# EasyEDA Pro project 电路设计.epro

# Schematic Schematic1
Board Name: Board1; Create Date: 2025-09-01; Page Name: P1; Project Name: ROS小车; Schematic Name: Schematic1; Update Date: 2025-09-03; Company: 嘉立创EDA; Page Size: A4; Version: V1.0
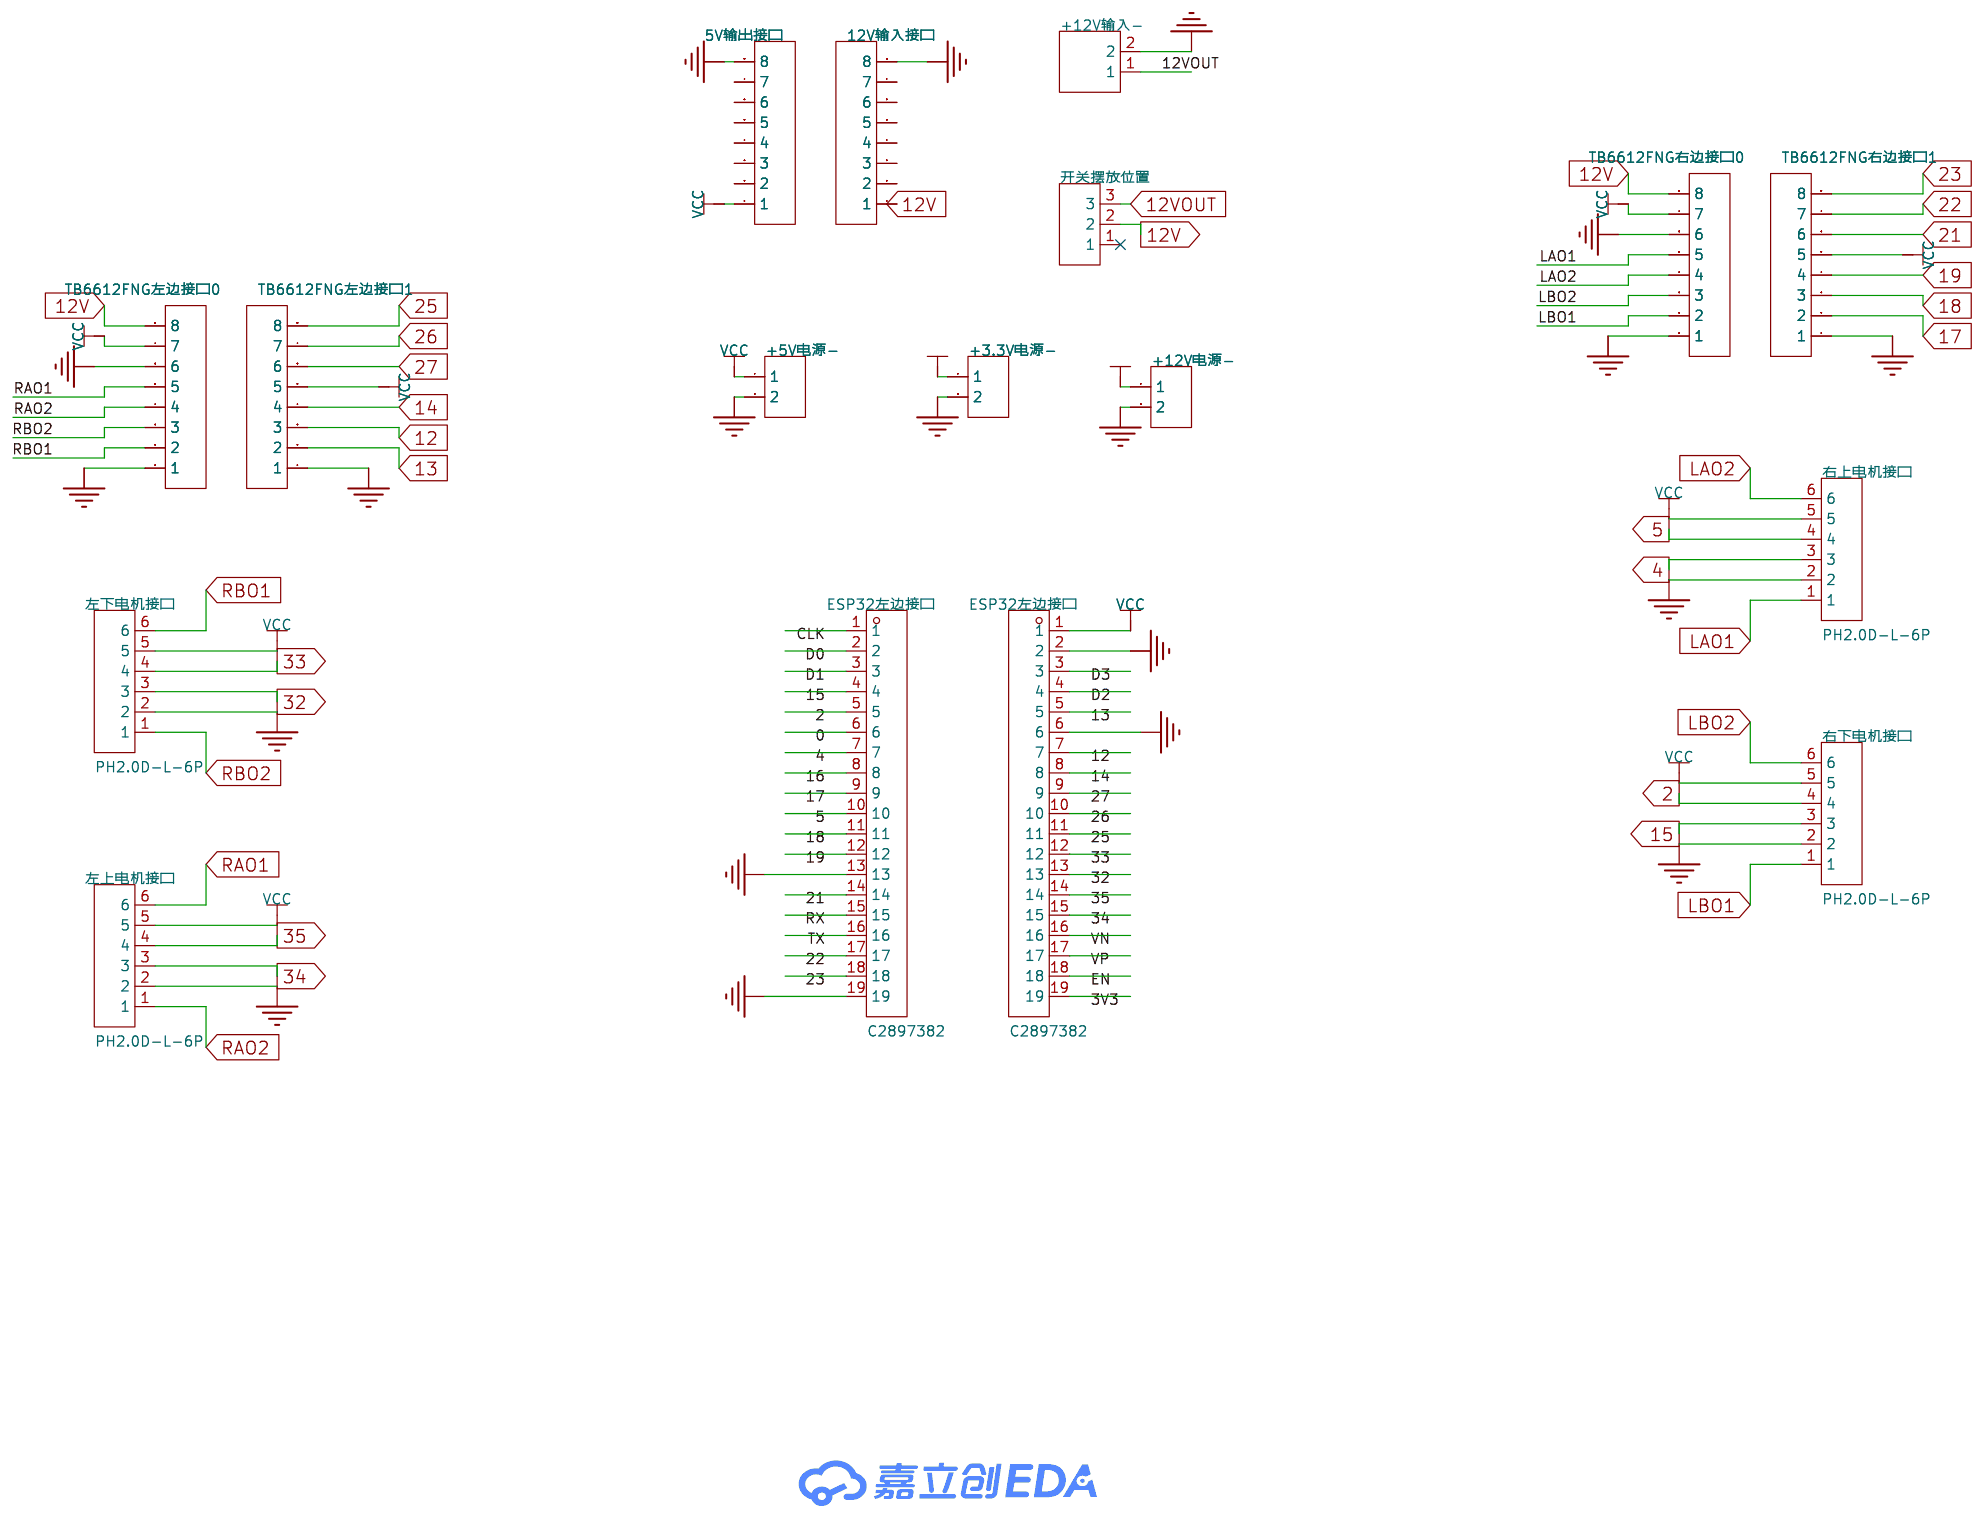
[diagram p0: schematic sheet]

## Parts
5V输出接口  -  [HDR-TH_8P-P2.54-V-F-1]
12V输入接口  -  [HDR-TH_8P-P2.54-V-F-1]
+3.3V电源-  -  [HDR-TH_2P-P2.54-V-F]
+5V电源-  -  [HDR-TH_2P-P2.54-V-F]
+12V电源-  -  [HDR-TH_2P-P2.54-V-F]
+12V输入-  -  [HDR-TH_2P-P2.54-V-M-1]
ESP32左边接口  C2897382  [HDR-TH_19P-P2.54-V-F]
ESP32左边接口#2  C2897382  [HDR-TH_19P-P2.54-V-F]
TB6612FNG右边接口0  -  [HDR-TH_8P-P2.54-V-F-1]
TB6612FNG右边接口1  -  [HDR-TH_8P-P2.54-V-F-1]
TB6612FNG左边接口0  -  [HDR-TH_8P-P2.54-V-F-1]
TB6612FNG左边接口1  -  [HDR-TH_8P-P2.54-V-F-1]
右上电机接口  PH2.0D-L-6P  [CONN-TH_6P_PH2.0D-L-6P]
右下电机接口  PH2.0D-L-6P  [CONN-TH_6P_PH2.0D-L-6P]
左上电机接口  PH2.0D-L-6P  [CONN-TH_6P_PH2.0D-L-6P]
左下电机接口  PH2.0D-L-6P  [CONN-TH_6P_PH2.0D-L-6P]
开关摆放位置  -  [HDR-TH_3P-P2.54-V-F]

## Library data of the parts
5V输出接口 12V输入接口 TB6612FNG右边接口0 TB6612FNG右边接口1 TB6612FNG左边接口0 TB6612FNG左边接口1 = HDR-F_2.54_1x8P: Supplier Part: C27438; Supplier Footprint: 插件
+3.3V电源- +5V电源- +12V电源- = HDR-F_2.54_1x2P: Supplier Part: C49661; Supplier Footprint: 插件
+12V输入- = HDR-M_2.54_1x2P: Supplier Part: C124375; Supplier Footprint: 插件
ESP32左边接口 ESP32左边接口#2 = HDR-F_2.54_1x19P: Supplier Footprint: 插件
右上电机接口 右下电机接口 左上电机接口 左下电机接口 = PH2.0D-L-6P: Supplier Part: C9900007791; Supplier Footprint: PH-6A(RED); JLCPCB Part Class: 扩展库; Supplier: LCSC
开关摆放位置 = HDR-F_2.54_1x3P: Supplier Part: C541850; Supplier Footprint: 插件

## Nets
3V3: +3.3V电源-.1 ESP32左边接口.19
12V: 12V输入接口.1 +12V电源-.1 TB6612FNG右边接口0.8 TB6612FNG左边接口0.8 开关摆放位置.2
12VOUT: +12V输入-.1 开关摆放位置.3
GND: 5V输出接口.8 12V输入接口.8 +3.3V电源-.2 +5V电源-.2 +12V电源-.2 +12V输入-.2 ESP32左边接口.2 ESP32左边接口.6 ESP32左边接口#2.13 ESP32左边接口#2.19 TB6612FNG右边接口0.1 TB6612FNG右边接口0.6 TB6612FNG右边接口1.1 TB6612FNG左边接口0.1 TB6612FNG左边接口0.6 TB6612FNG左边接口1.1 右上电机接口.2 右下电机接口.2 左上电机接口.2 左下电机接口.2
VCC: 5V输出接口.1 +5V电源-.1 ESP32左边接口.1 TB6612FNG右边接口0.7 TB6612FNG右边接口1.5 TB6612FNG左边接口0.7 TB6612FNG左边接口1.5 右上电机接口.5 右下电机接口.5 左上电机接口.5 左下电机接口.5
0: ESP32左边接口#2.6
2: ESP32左边接口#2.5 右下电机接口.4
4: ESP32左边接口#2.7 右上电机接口.3
5: ESP32左边接口#2.10 右上电机接口.4
12: ESP32左边接口.7 TB6612FNG左边接口1.3
13: ESP32左边接口.5 TB6612FNG左边接口1.2
14: ESP32左边接口.8 TB6612FNG左边接口1.4
15: ESP32左边接口#2.4 右下电机接口.3
16: ESP32左边接口#2.8
17: ESP32左边接口#2.9 TB6612FNG右边接口1.2
18: ESP32左边接口#2.11 TB6612FNG右边接口1.3
19: ESP32左边接口#2.12 TB6612FNG右边接口1.4
21: ESP32左边接口#2.14 TB6612FNG右边接口1.6
22: ESP32左边接口#2.17 TB6612FNG右边接口1.7
23: ESP32左边接口#2.18 TB6612FNG右边接口1.8
25: ESP32左边接口.11 TB6612FNG左边接口1.8
26: ESP32左边接口.10 TB6612FNG左边接口1.7
27: ESP32左边接口.9 TB6612FNG左边接口1.6
32: ESP32左边接口.13 左下电机接口.3
33: ESP32左边接口.12 左下电机接口.4
34: ESP32左边接口.15 左上电机接口.3
35: ESP32左边接口.14 左上电机接口.4
CLK: ESP32左边接口#2.1
D0: ESP32左边接口#2.2
D1: ESP32左边接口#2.3
D2: ESP32左边接口.4
D3: ESP32左边接口.3
EN: ESP32左边接口.18
LAO1: TB6612FNG右边接口0.5 右上电机接口.1
LAO2: TB6612FNG右边接口0.4 右上电机接口.6
LBO1: TB6612FNG右边接口0.2 右下电机接口.1
LBO2: TB6612FNG右边接口0.3 右下电机接口.6
RAO1: TB6612FNG左边接口0.5 左上电机接口.6
RAO2: TB6612FNG左边接口0.4 左上电机接口.1
RBO1: TB6612FNG左边接口0.2 左下电机接口.6
RBO2: TB6612FNG左边接口0.3 左下电机接口.1
RX: ESP32左边接口#2.15
TX: ESP32左边接口#2.16
VN: ESP32左边接口.16
VP: ESP32左边接口.17

Not connected (* = marked no-connect by the designer): 5V输出接口 2 3 4 5 6 7; 12V输入接口 2 3 4 5 6 7; 开关摆放位置 1*

# Board PCB1
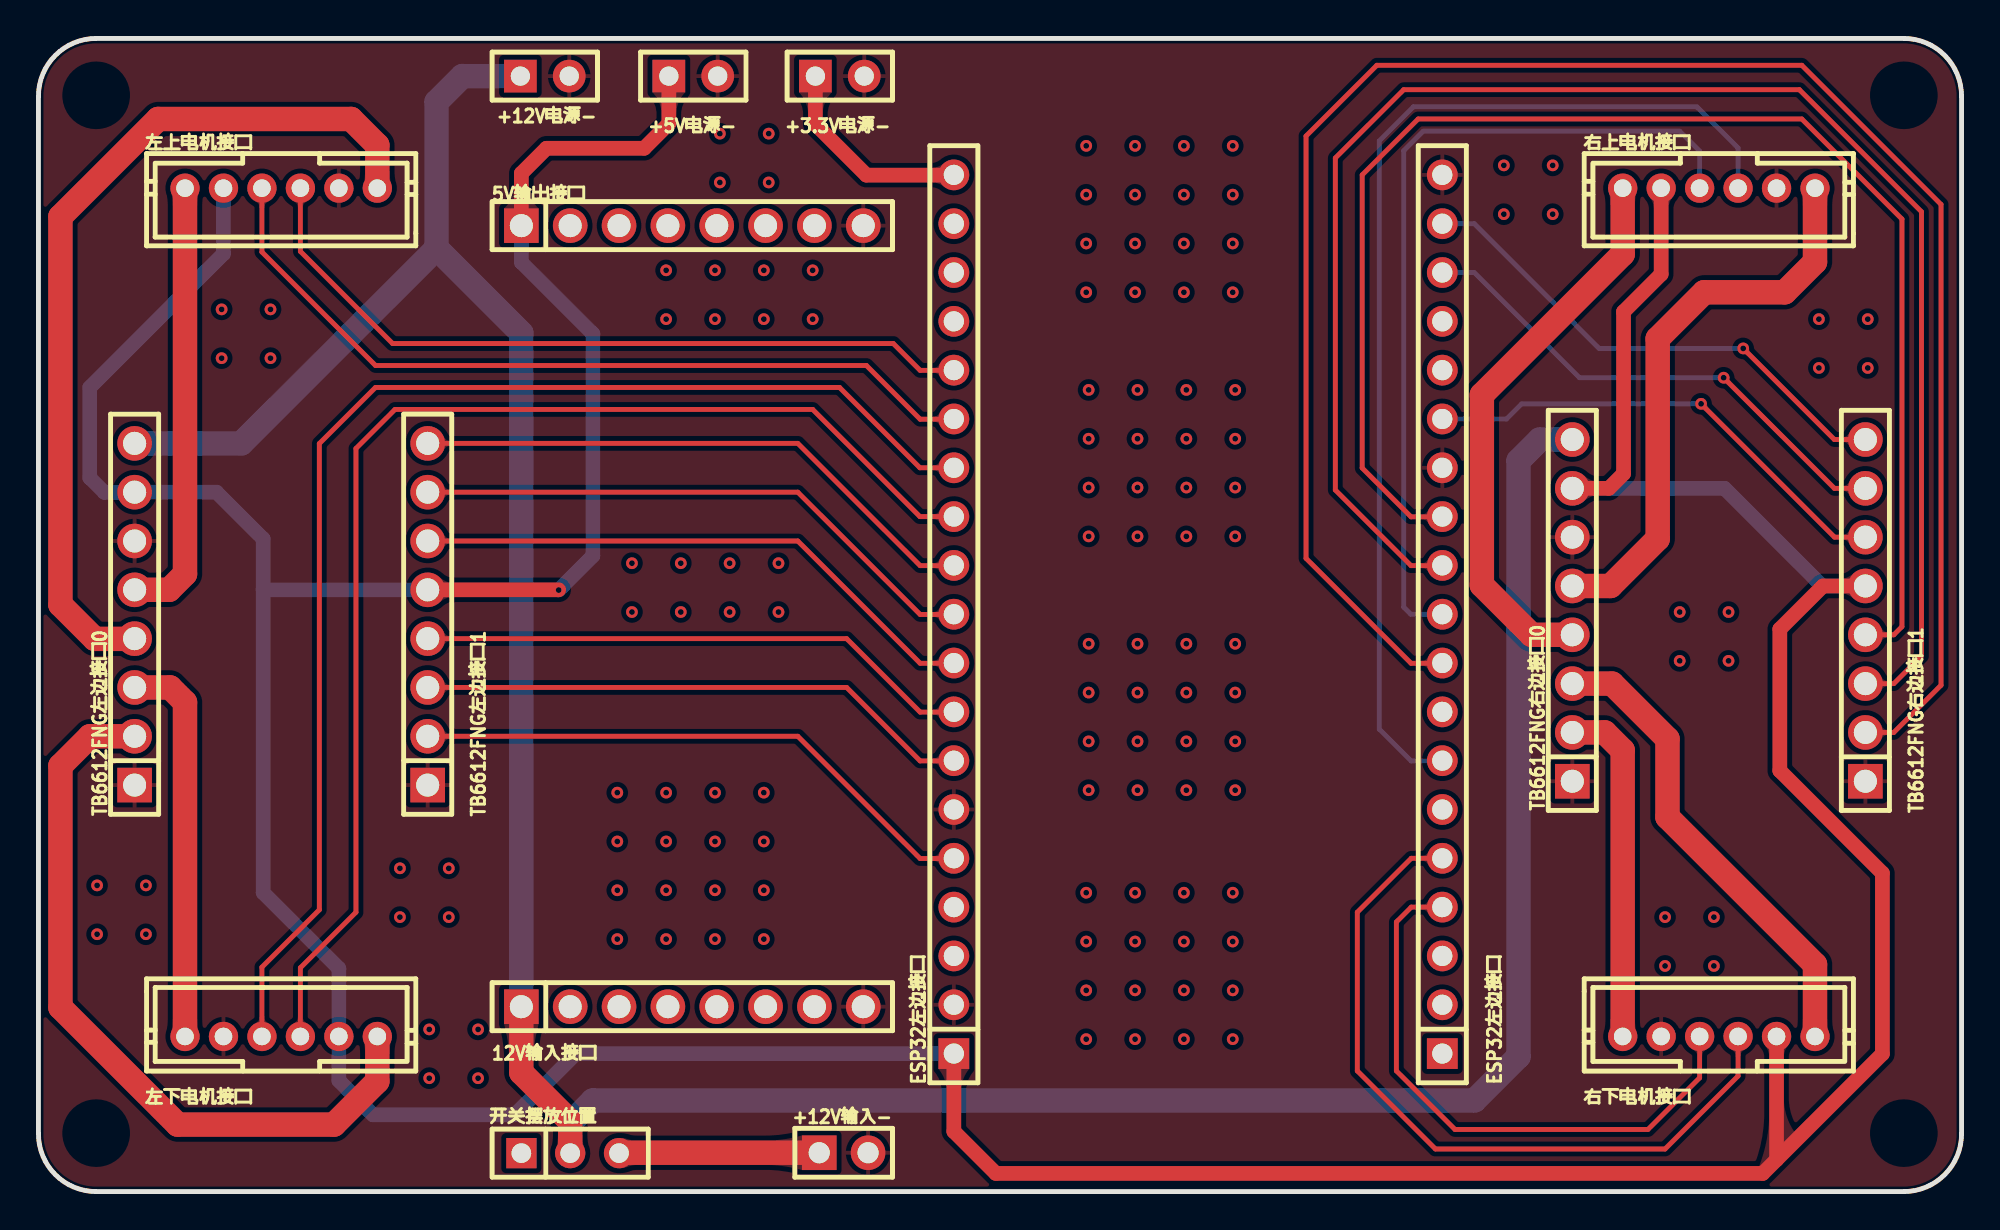
[diagram p1: board, top side]
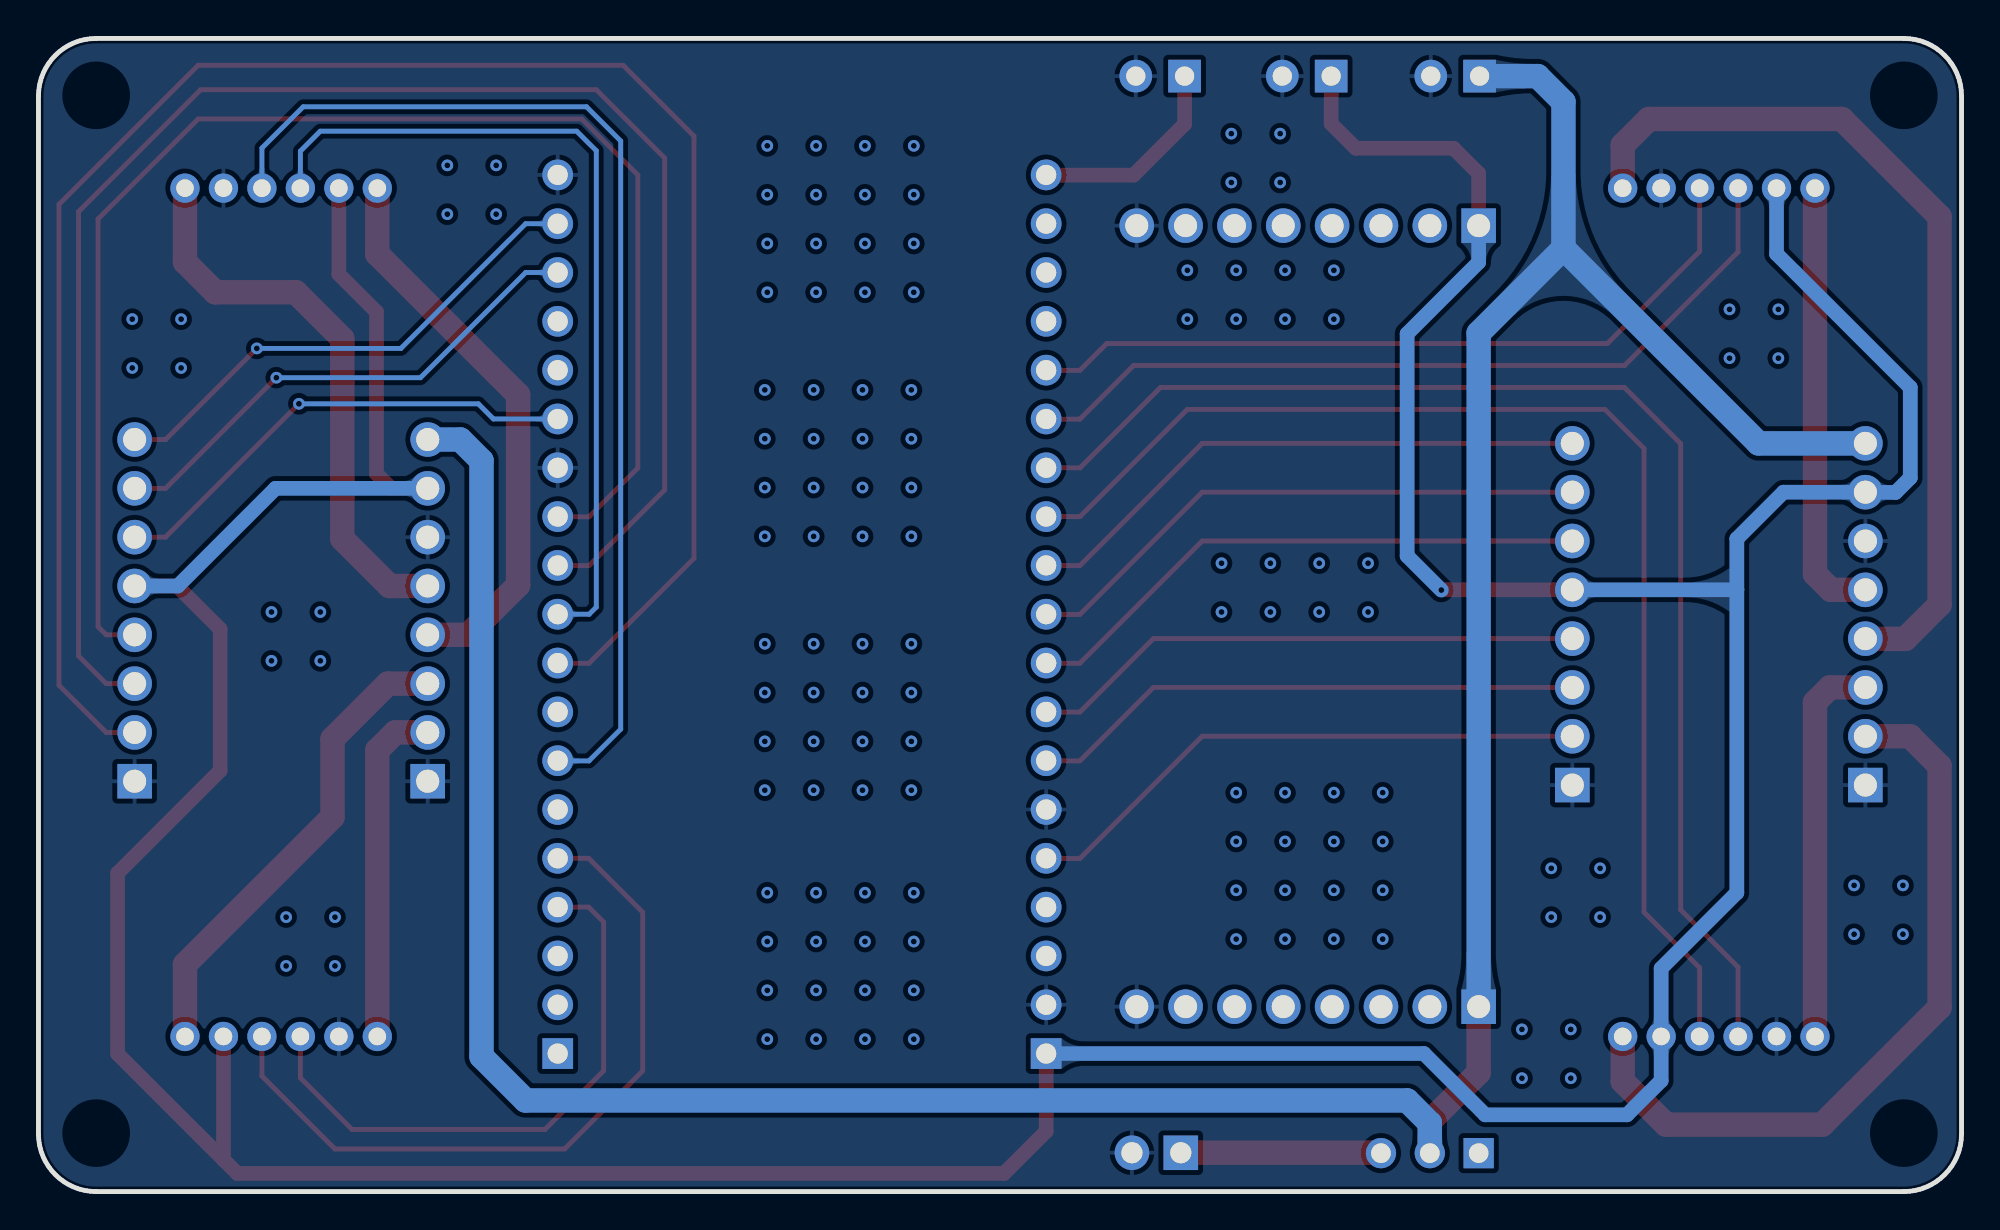
[diagram p2: board, bottom side, seen from below]

Outline 100 x 60 mm; copper layers: Top Layer, Bottom Layer. Coordinates in mm from the lower left corner of the outline.
Outline path: 0,57 0,3 arc(0.88,0.88) 3,0 97,0 arc(99.12,0.88) 100,3 100,57 arc(99.12,59.12) 97,60 3,60 arc(0.88,59.12) 0,57
Stack: Top Layer 0.035mm / Dielectric1 1.51mm FR4 er 4.5 / Bottom Layer 0.035mm

## Design rules (mm)
template: JLCPCB Capability(Two Layers Board)
spacing copperThickness1oz (default): track to track 0.102, other pairs 0.152 to 0.3
spacing copperThickness2oz: track to track 0.203, other pairs 0.152 to 0.3
track width copperThickness1oz (default): min 0.127, default 0.254, max 2.54
track width copperThickness2oz: min 0.203, default 0.254, max 2.54
differential pair differentialPair (default): width min 0.127, default 0.254, max 2.54; gap min 0.152, default 0.152
via viaSize (default): diameter min 0.5, default 0.61, max 10; hole min 0.3, default 0.305, max 6.3

## Placement (name value [footprint] x y rotation side)
5V输出接口  -  [HDR-TH_8P-P2.54-V-F-1]  34 50.26 0 top
12V输入接口  -  [HDR-TH_8P-P2.54-V-F-1]  34 9.62 0 top
+3.3V电源-  -  [HDR-TH_2P-P2.54-V-F]  41.67 58.04 0 top
+5V电源-  -  [HDR-TH_2P-P2.54-V-F]  34.05 58.04 0 top
+12V电源-  -  [HDR-TH_2P-P2.54-V-F]  26.33 58.04 0 top
+12V输入-  -  [HDR-TH_2P-P2.54-V-M-1]  41.87 2.02 0 top
ESP32左边接口  C2897382  [HDR-TH_19P-P2.54-V-F]  73 30.04 90 top
ESP32左边接口#2  C2897382  [HDR-TH_19P-P2.54-V-F]  47.6 30.04 90 top
TB6612FNG右边接口0  -  [HDR-TH_8P-P2.54-V-F-1]  79.76 30.24 90 top
TB6612FNG右边接口1  -  [HDR-TH_8P-P2.54-V-F-1]  95 30.24 90 top
TB6612FNG左边接口0  -  [HDR-TH_8P-P2.54-V-F-1]  5 30.04 90 top
TB6612FNG左边接口1  -  [HDR-TH_8P-P2.54-V-F-1]  20.24 30.04 90 top
右上电机接口  PH2.0D-L-6P  [CONN-TH_6P_PH2.0D-L-6P]  87.38 52.21 180 top
右下电机接口  PH2.0D-L-6P  [CONN-TH_6P_PH2.0D-L-6P]  87.38 8.07 0 top
左上电机接口  PH2.0D-L-6P  [CONN-TH_6P_PH2.0D-L-6P]  12.62 52.21 180 top
左下电机接口  PH2.0D-L-6P  [CONN-TH_6P_PH2.0D-L-6P]  12.62 8.07 0 top
开关摆放位置  -  [HDR-TH_3P-P2.54-V-F]  27.65 2 0 top

## Footprints (pads in the part's own frame, mm; a bottom-side part is the same pattern mirrored in y, then rotated)
CONN-TH_6P_PH2.0D-L-6P
  round 1.524 hole 0.914: 1(-5,0) 2(-3,0) 3(-1,0) 4(1,0) 5(3,0) 6(5,0)
HDR-TH_2P-P2.54-V-F
  rect 1.7x1.7 hole 1: 1(-1.27,0)
  round 1.7 hole 1: 2(1.27,0)
HDR-TH_2P-P2.54-V-M-1
  rect 1.8x1.8 hole 1.1: 1(-1.27,0)
  round 1.8 hole 1.1: 2(1.27,0)
HDR-TH_3P-P2.54-V-F
  rect 1.575x1.575 hole 1.02: 1(-2.54,0)
  round 1.575 hole 1.02: 2(0,0) 3(2.54,0)
HDR-TH_8P-P2.54-V-F-1
  rect 1.8x1.8 hole 1.2: 1(-8.89,0)
  round 1.8 hole 1.2: 2(-6.35,0) 3(-3.81,0) 4(-1.27,0) 5(1.27,0) 6(3.81,0) 7(6.35,0) 8(8.89,0)
HDR-TH_19P-P2.54-V-F
  rect 1.6x1.6 hole 1.05: 1(-22.86,0)
  round 1.6 hole 1.05: 2(-20.32,0) 3(-17.78,0) 4(-15.24,0) 5(-12.7,0) 6(-10.16,0) 7(-7.62,0) 8(-5.08,0) 9(-2.54,0) 10(0,0) 11(2.54,0) 12(5.08,0) 13(7.62,0) 14(10.16,0) 15(12.7,0) 16(15.24,0) 17(17.78,0) 18(20.32,0) 19(22.86,0)

## Nets
3V3: +3.3V电源-.1 ESP32左边接口#2.19
12V: 12V输入接口.1 +12V电源-.1 TB6612FNG右边接口0.8 TB6612FNG左边接口0.8 开关摆放位置.2
12VOUT: +12V输入-.1 开关摆放位置.3
GND: 5V输出接口.8 12V输入接口.8 +3.3V电源-.2 +5V电源-.2 +12V电源-.2 +12V输入-.2 ESP32左边接口.13 ESP32左边接口.19 ESP32左边接口#2.2 ESP32左边接口#2.6 TB6612FNG右边接口0.1 TB6612FNG右边接口0.6 TB6612FNG右边接口1.1 TB6612FNG左边接口0.1 TB6612FNG左边接口0.6 TB6612FNG左边接口1.1 右上电机接口.2 右下电机接口.2 左上电机接口.2 左下电机接口.2
VCC: 5V输出接口.1 +5V电源-.1 ESP32左边接口#2.1 TB6612FNG右边接口0.7 TB6612FNG右边接口1.5 TB6612FNG左边接口0.7 TB6612FNG左边接口1.5 右上电机接口.5 右下电机接口.5 左上电机接口.5 左下电机接口.5
0: ESP32左边接口.6
2: ESP32左边接口.5 右下电机接口.4
4: ESP32左边接口.7 右上电机接口.3
5: ESP32左边接口.10 右上电机接口.4
12: ESP32左边接口#2.7 TB6612FNG左边接口1.3
13: ESP32左边接口#2.5 TB6612FNG左边接口1.2
14: ESP32左边接口#2.8 TB6612FNG左边接口1.4
15: ESP32左边接口.4 右下电机接口.3
16: ESP32左边接口.8
17: ESP32左边接口.9 TB6612FNG右边接口1.2
18: ESP32左边接口.11 TB6612FNG右边接口1.3
19: ESP32左边接口.12 TB6612FNG右边接口1.4
21: ESP32左边接口.14 TB6612FNG右边接口1.6
22: ESP32左边接口.17 TB6612FNG右边接口1.7
23: ESP32左边接口.18 TB6612FNG右边接口1.8
25: ESP32左边接口#2.11 TB6612FNG左边接口1.8
26: ESP32左边接口#2.10 TB6612FNG左边接口1.7
27: ESP32左边接口#2.9 TB6612FNG左边接口1.6
32: ESP32左边接口#2.13 左下电机接口.3
33: ESP32左边接口#2.12 左下电机接口.4
34: ESP32左边接口#2.15 左上电机接口.3
35: ESP32左边接口#2.14 左上电机接口.4
CLK: ESP32左边接口.1
D0: ESP32左边接口.2
D1: ESP32左边接口.3
D2: ESP32左边接口#2.4
D3: ESP32左边接口#2.3
EN: ESP32左边接口#2.18
LAO1: TB6612FNG右边接口0.5 右上电机接口.1
LAO2: TB6612FNG右边接口0.4 右上电机接口.6
LBO1: TB6612FNG右边接口0.2 右下电机接口.1
LBO2: TB6612FNG右边接口0.3 右下电机接口.6
RAO1: TB6612FNG左边接口0.5 左上电机接口.6
RAO2: TB6612FNG左边接口0.4 左上电机接口.1
RBO1: TB6612FNG左边接口0.2 左下电机接口.6
RBO2: TB6612FNG左边接口0.3 左下电机接口.1
RX: ESP32左边接口.15
TX: ESP32左边接口.16
VN: ESP32左边接口#2.16
VP: ESP32左边接口#2.17

Pads without a net: 5V输出接口 2 3 4 5 6 7; 12V输入接口 2 3 4 5 6 7; 开关摆放位置 1

## Via types
v1: diameter 0.61, hole 0.305, Top Layer to Bottom Layer, 136 vias

## Routing (per net, layer and track width the routed paths; a pad name or vN(x,y) marks a point on that pad's centre or on a via; arc(x,y) is an arc through that point)
3V3: length 10.8
  Top Layer w0.762: ESP32左边接口#2.19 47.59,52.89 43.05,52.89 40.4,55.54 +3.3V电源-.1
12V: length 169
  Top Layer w1.27: 12V输入接口.1 25.11,6.19 27.65,3.65 开关摆放位置.2
  Bottom Layer w1.27: 20.7,49.08 20.7,56.7 22.04,58.04 +12V电源-.1 ; 20.7,49.08 10.55,38.93 TB6612FNG左边接口0.8 ; 20.7,49.08 25.11,44.67 12V输入接口.1 ; TB6612FNG右边接口0.8 78.06,39.13 76.96,38.03 76.96,7.03 74.68,4.74 28.83,4.74 27.65,3.56 开关摆放位置.2
12VOUT: length 10.4
  Top Layer w1.27: 开关摆放位置.3 30.21,2.02 +12V输入-.1
VCC: length 270.7
  Top Layer w0.762: 90.38,1.66 95.88,7.17 95.88,16.57 90.55,21.9 90.55,29.27 92.79,31.51 TB6612FNG右边接口1.5 ; 90.38,1.66 89.66,0.94 49.78,0.94 47.6,3.13 ESP32左边接口#2.1 ; 90.38,1.66 右下电机接口.5 ; 5V输出接口.1 25.11,52.98 26.42,54.28 31.5,54.28 32.78,55.57 +5V电源-.1 ; TB6612FNG右边接口0.7 81.66,36.59 82.42,37.35 82.42,45.78 84.38,47.73 右上电机接口.5 ; TB6612FNG左边接口1.5 27.05,31.31
  Bottom Layer w0.762: 94.96,31.55 TB6612FNG右边接口1.5 92.75,31.51 87.67,36.59 TB6612FNG右边接口0.7 ; 5V输出接口.1 25.11,48.35 28.83,44.63 28.83,33.08 v1(27.05,31.3) ; 11.68,31.32 11.68,15.55 15.62,11.61 15.62,8.07 ; 11.68,31.32 11.68,33.97 9.26,36.39 TB6612FNG左边接口0.7 4.99,36.38 3.43,36.38 2.67,37.14 2.67,41.84 9.62,48.79 左上电机接口.5 ; 11.68,31.32 11.69,31.31 TB6612FNG左边接口1.5 ; 左下电机接口.5 15.62,5.77 17.4,3.99 24.77,3.99 27.95,7.18 ESP32左边接口#2.1
(no net):
  vias: v1(3.05,15.93) v1(3.05,13.39) v1(5.59,15.93) v1(5.59,13.39) v1(9.53,45.9) v1(9.53,43.36) v1(12.06,45.9) v1(12.06,43.36) v1(18.8,16.82) v1(18.8,14.28) v1(20.32,8.44) v1(20.32,5.9) v1(21.34,16.82) v1(21.34,14.28) v1(22.86,8.44) v1(22.86,5.9) v1(30.1,20.76) v1(30.1,18.22) v1(30.1,15.68) v1(30.1,13.14) v1(30.86,32.69) v1(30.86,30.16) v1(32.64,47.94) v1(32.64,45.39) v1(32.64,20.76) v1(32.64,18.22) v1(32.64,15.68) v1(32.64,13.14) v1(33.4,32.69) v1(33.4,30.16) v1(35.18,47.94) v1(35.18,45.39) v1(35.18,20.76) v1(35.18,18.22) v1(35.18,15.68) v1(35.18,13.14) v1(35.43,55.05) v1(35.43,52.51) v1(35.94,32.69) v1(35.94,30.16) v1(37.72,47.94) v1(37.72,45.39) v1(37.72,20.76) v1(37.72,18.22) v1(37.72,15.68) v1(37.72,13.14) v1(37.97,55.05) v1(37.97,52.51) v1(38.48,32.69) v1(38.48,30.16) v1(40.26,47.94) v1(40.26,45.39) v1(54.48,54.41) v1(54.48,51.87) v1(54.48,49.33) v1(54.48,46.79) v1(54.48,15.55) v1(54.48,13.01) v1(54.48,10.47) v1(54.48,7.93) v1(54.61,41.71) v1(54.61,39.17) v1(54.61,36.63) v1(54.61,34.09) v1(54.61,28.5) v1(54.61,25.96) v1(54.61,23.42) v1(54.61,20.88) v1(57.02,54.41) v1(57.02,51.87) v1(57.02,49.33) v1(57.02,46.79) v1(57.02,15.55) v1(57.02,13.01) v1(57.02,10.47) v1(57.02,7.93) v1(57.15,41.71) v1(57.15,39.17) v1(57.15,36.63) v1(57.15,34.09) v1(57.15,28.5) v1(57.15,25.96) v1(57.15,23.42) v1(57.15,20.88) v1(59.56,54.41) v1(59.56,51.87) v1(59.56,49.33) v1(59.56,46.79) v1(59.56,15.55) v1(59.56,13.01) v1(59.56,10.47) v1(59.56,7.93) v1(59.69,41.71) v1(59.69,39.17) v1(59.69,36.63) v1(59.69,34.09) v1(59.69,28.5) v1(59.69,25.96) v1(59.69,23.42) v1(59.69,20.88) v1(62.1,54.41) v1(62.1,51.87) v1(62.1,49.33) v1(62.1,46.79) v1(62.1,15.55) v1(62.1,13.01) v1(62.1,10.47) v1(62.1,7.93) v1(62.23,41.71) v1(62.23,39.17) v1(62.23,36.63) v1(62.23,34.09) v1(62.23,28.5) v1(62.23,25.96) v1(62.23,23.42) v1(62.23,20.88) v1(76.2,53.4) v1(76.2,50.86) v1(78.74,53.4) v1(78.74,50.86) v1(84.58,14.28) v1(84.58,11.74) v1(85.34,30.16) v1(85.34,27.61) v1(87.12,14.28) v1(87.12,11.74) v1(87.88,30.16) v1(87.88,27.61) v1(92.58,45.39) v1(92.58,42.86) v1(95.12,45.39) v1(95.12,42.86)
2: length 39
  Top Layer w0.254: ESP32左边接口.5 71.39,17.34 68.58,14.53 68.58,6.28 72.64,2.22 84.58,2.22 88.38,6.01 右下电机接口.4
4: length 56.9
  Bottom Layer w0.254: 右上电机接口.3 88.38,54.3 86.23,56.44 71.5,56.44 69.72,54.67 69.72,24.06 71.37,22.41 72.99,22.41 ESP32左边接口.7
5: length 44.1
  Bottom Layer w0.254: 右上电机接口.4 86.38,54.14 85.34,55.17 72.01,55.17 70.99,54.16 70.99,30.41 71.36,30.04 ESP32左边接口.10
12: length 28.9
  Top Layer w0.254: TB6612FNG左边接口1.3 42.03,26.23 45.85,22.41 47.59,22.41 ESP32左边接口#2.7
13: length 30
  Top Layer w0.254: TB6612FNG左边接口1.2 39.49,23.69 45.85,17.33 47.59,17.33 ESP32左边接口#2.5
14: length 28.9
  Top Layer w0.254: TB6612FNG左边接口1.4 42.03,28.77 45.85,24.95 47.59,24.95 ESP32左边接口#2.8
15: length 30.8
  Top Layer w0.254: 右下电机接口.3 86.38,5.92 83.69,3.23 73.66,3.23 70.61,6.28 70.61,14.03 71.39,14.8 ESP32左边接口.4
17: length 98.8
  Top Layer w0.254: TB6612FNG右边接口1.2 96.48,23.89 98.93,26.34 98.93,51.36 91.69,58.6 69.6,58.6 65.91,54.92 65.91,32.95 71.37,27.49 72.99,27.49 ESP32左边接口.9
18: length 85.7
  Top Layer w0.254: ESP32左边接口.11 72.99,32.57 71.37,32.57 67.44,36.5 67.44,53.78 70.99,57.33 91.57,57.33 97.92,50.98 97.92,27.87 96.48,26.43 TB6612FNG右边接口1.3
19: length 75.2
  Top Layer w0.254: ESP32左边接口.12 72.99,35.11 71.37,35.11 68.83,37.65 68.83,52.9 71.74,55.81 91.69,55.81 96.9,50.6 96.9,29.39 96.48,28.97 TB6612FNG右边接口1.4
21: length 25.2
  Top Layer w0.254: TB6612FNG右边接口1.6 93.4,34.05 v1(86.46,40.99)
  Bottom Layer w0.254: v1(86.46,40.99) 77.13,40.99 76.34,40.2 ESP32左边接口.14
22: length 26.7
  Top Layer w0.254: v1(87.63,42.35) 93.39,36.59 TB6612FNG右边接口1.7
  Bottom Layer w0.254: v1(87.63,42.35) 80.14,42.35 74.66,47.82 ESP32左边接口.17
23: length 26.7
  Top Layer w0.254: TB6612FNG右边接口1.8 93.39,39.13 v1(88.65,43.87)
  Bottom Layer w0.254: ESP32左边接口.18 74.66,50.36 81.15,43.87 v1(88.65,43.87)
25: length 30
  Top Layer w0.254: TB6612FNG左边接口1.8 39.49,38.93 45.85,32.57 47.59,32.57 ESP32左边接口#2.11
26: length 30
  Top Layer w0.254: ESP32左边接口#2.10 47.59,30.03 45.85,30.03 39.49,36.39 TB6612FNG左边接口1.7
27: length 30
  Top Layer w0.254: TB6612FNG左边接口1.6 39.49,33.85 45.85,27.49 47.59,27.49 ESP32左边接口#2.9
32: length 68
  Top Layer w0.254: 左下电机接口.3 11.62,11.68 14.61,14.66 14.61,38.92 17.53,41.84 41.66,41.84 45.84,37.66 ESP32左边接口#2.13
33: length 66
  Top Layer w0.254: ESP32左边接口#2.12 45.84,35.12 40.26,40.7 18.54,40.7 16.51,38.66 16.51,14.53 13.62,11.64 左下电机接口.4
34: length 39.8
  Top Layer w0.254: ESP32左边接口#2.15 47.59,42.73 45.85,42.73 44.45,44.12 18.42,44.12 13.62,48.92 左上电机接口.3
35: length 42.9
  Top Layer w0.254: ESP32左边接口#2.14 47.59,40.19 45.85,40.19 43.05,42.98 17.53,42.98 11.62,48.89 左上电机接口.4
LAO1: length 29.5
  Top Layer w1.27: 右上电机接口.1 92.38,48.37 90.81,46.79 86.61,46.79 84.2,44.38 84.2,33.97 81.75,31.51 TB6612FNG右边接口0.5
LAO2: length 29.5
  Top Layer w1.27: 右上电机接口.6 82.38,48.78 75.06,41.46 75.06,31.55 77.64,28.97 TB6612FNG右边接口0.4
LBO1: length 17.9
  Top Layer w1.27: TB6612FNG右边接口0.2 81.45,23.89 82.38,22.96 右下电机接口.1
LBO2: length 24.8
  Top Layer w1.27: 右下电机接口.6 92.38,11.82 84.71,19.49 84.71,23.55 81.83,26.43 TB6612FNG右边接口0.3
RAO1: length 23
  Top Layer w1.27: TB6612FNG左边接口0.5 6.8,31.31 7.62,32.13 左上电机接口.6
RAO2: length 46.2
  Top Layer w1.27: TB6612FNG左边接口0.4 4.99,28.76 2.92,28.76 1.14,30.54 1.14,50.73 6.22,55.81 16.26,55.81 17.62,54.44 左上电机接口.1
RBO1: length 39.3
  Top Layer w1.27: 左下电机接口.6 17.62,5.74 15.37,3.49 7.24,3.49 1.14,9.58 1.14,22.15 2.68,23.69 TB6612FNG左边接口0.2
RBO2: length 20.3
  Top Layer w1.27: TB6612FNG左边接口0.3 6.85,26.23 7.62,25.46 左下电机接口.1

## Copper pours and planes (outline as drawn; the poured copper is in the pictures)
GND on Top Layer: -38.48,78.16 130.3,78.16 130.3,-19.76 -38.48,-19.76
GND on Bottom Layer: -22.86,66.6 111.51,66.6 111.51,-12.77 -22.86,-12.77

Small or netless copper shapes (teardrops, artwork), in the pictures only: 67 on Top Layer, 27 on Bottom Layer
